# EAGLE schematic Peripheral_MABOS (EAGLE 9.7.0)
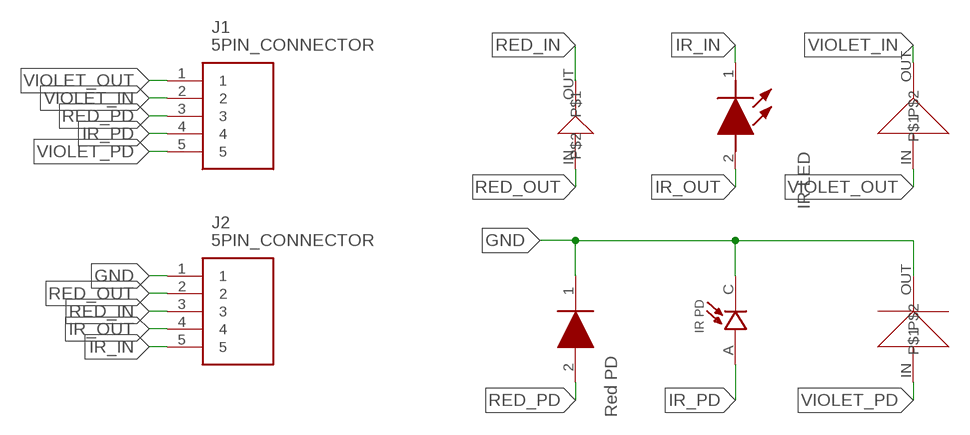
[diagram p0: schematic, sheet 1]

## Parts
D1  REDPD  [SFH2713]
D2  IRPD  [XDCR_VEMD2023X01]
J1  5PIN_CONNECTOR  [SHDR5W114P0X419_1X5_2228X658X1]
J2  5PIN_CONNECTOR  [SHDR5W114P0X419_1X5_2228X658X1]
LED1  IRLED  [LEDC3216X180N]
U$1  REDLED  [REDLED]
U$2  UVLED  [UVLED]
U$3  UVPD  [UVPD]

## Nets
GND: D1.1(K) D2.C J2.1 U$3.OUT
IR_IN: J2.5 LED1.1(K)
IR_OUT: J2.4 LED1.2(A)
IR_PD: D2.A J1.4
RED_IN: J2.3 U$1.OUT
RED_OUT: J2.2 U$1.IN
RED_PD: D1.2(A) J1.3
VIOLET_IN: J1.2 U$2.OUT
VIOLET_OUT: J1.1 U$2.IN
VIOLET_PD: J1.5 U$3.IN

## Library data of the parts
D1 = MABOS_components:REDPD: Photodiodes Silicon PIN Photodiode Source: Datasheet <https://dammedia.osram.info/media/resource/hires/osram-dam-8960377/SFH 2713_EN.pdf>; DESCRIPTION: Photodiodes Silicon PIN Photodiode; HEIGHT: 0.7mm; MANUFACTURER_NAME: OSRAM; MANUFACTURER_PART_NUMBER: SFH 2713; MOUSER_PART_NUMBER: 720-SFH2713; MOUSER_PRICE-STOCK: https://www.mouser.co.uk/ProductDetail/OSRAM-Opto-Semiconductors/SFH-2713?qs=7MVldsJ5UayBhtoy5c4X7w%3D%3D
D2 = MABOS_components:IRPD: Check availability <https://pricing.snapeda.com/parts/VEMD2023X01/Vishay%20Semiconductor/view-part?ref=eda>; AVAILABILITY: In Stock; DESCRIPTION: Photodiode 940nm 100ns 70° 2-SMD; MF: Vishay Semiconductor; MP: VEMD2023X01; PACKAGE: SMD-2 Vishay Semiconductor; PRICE: None; PURCHASE-URL: https://pricing.snapeda.com/search/part/VEMD2023X01/?ref=eda
J1 J2 = MABOS_components:5PIN_CONNECTOR: Samtec IPBT, 4.19mm Pitch, 5 Way, 1 Row PCB Terminal Block Header, Through Hole Source: Datasheet <http://suddendocs.samtec.com/catalog_english/ipbt.pdf>; DESCRIPTION: Samtec IPBT, 4.19mm Pitch, 5 Way, 1 Row PCB Terminal Block Header, Through Hole; HEIGHT: 10.29mm; MANUFACTURER_NAME: SAMTEC; MANUFACTURER_PART_NUMBER: IPBT-105-H1-T-S-K; MOUSER_PART_NUMBER: 200-IPBT105H1TSK; MOUSER_PRICE-STOCK: https://www.mouser.co.uk/ProductDetail/Samtec/IPBT-105-H1-T-S-K?qs=PB6%2FjmICvI0oo3MGzaPD2A%3D%3D
LED1 = MABOS_components:IRLED: Infrared Emitters 3.2x1.6mm IR SMD LED Source: Datasheet <https://www.arrow.com/en/products/aptd3216f3c-p22/kingbright>; DESCRIPTION: Infrared Emitters 3.2x1.6mm IR SMD LED; HEIGHT: 1.8mm; MANUFACTURER_NAME: Kingbright; MANUFACTURER_PART_NUMBER: APTD3216F3C-P22; MOUSER_PART_NUMBER: 604-APTD3216F3C-P22; MOUSER_PRICE-STOCK: https://www.mouser.co.uk/ProductDetail/Kingbright/APTD3216F3C-P22?qs=fAHHVMwC%252Bbjo55EMkwMBzg%3D%3D
U$1 = MABOS_components:REDLED
U$2 = MABOS_components:UVLED
U$3 = MABOS_components:UVPD